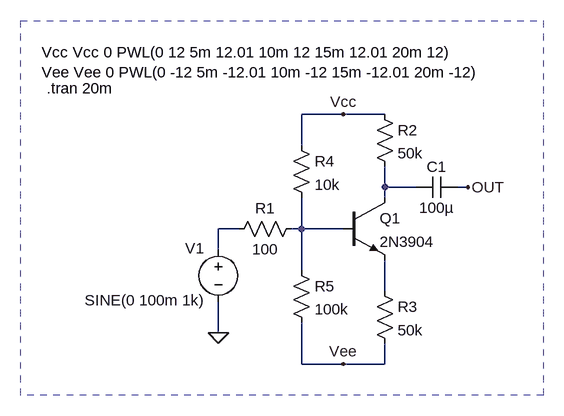
[diagram p0: schematic PSRR_Example.asc]
PSRR_Example.asc, the LTspice schematic file:
Version 4
SHEET 1 880 680
WIRE 416 16 352 16
WIRE 480 16 416 16
WIRE 352 64 352 16
WIRE 480 128 480 96
WIRE 528 128 480 128
WIRE 608 128 592 128
WIRE 480 144 480 128
WIRE 256 192 224 192
WIRE 352 192 352 144
WIRE 352 192 336 192
WIRE 416 192 352 192
WIRE 224 224 224 192
WIRE 352 256 352 192
WIRE 480 288 480 240
WIRE 224 352 224 304
WIRE 352 400 352 336
WIRE 416 400 352 400
WIRE 480 400 480 368
WIRE 480 400 416 400
FLAG 224 352 0
FLAG 608 128 OUT
FLAG 416 16 Vcc
FLAG 416 400 Vee
SYMBOL npn 416 144 R0
SYMATTR InstName Q1
SYMATTR Value 2N3904
SYMBOL Res 352 176 R90
WINDOW 0 0 56 VBottom 2
WINDOW 3 32 56 VTop 2
SYMATTR InstName R1
SYMATTR Value 100
SYMBOL Res 464 0 R0
SYMATTR InstName R2
SYMATTR Value 50k
SYMBOL Res 464 272 R0
SYMATTR InstName R3
SYMATTR Value 50k
SYMBOL Cap 592 112 R90
WINDOW 0 0 32 VBottom 2
WINDOW 3 32 32 VTop 2
SYMATTR InstName C1
SYMATTR Value 100µ
SYMBOL Voltage 224 208 R0
WINDOW 0 -51 14 Left 2
WINDOW 3 -206 94 Left 2
SYMATTR InstName V1
SYMATTR Value SINE(0 100m 1k)
SYMBOL Res 336 48 R0
SYMATTR InstName R4
SYMATTR Value 10k
SYMBOL Res 336 240 R0
SYMATTR InstName R5
SYMATTR Value 100k
TEXT -40 -24 Left 2 !.tran 20m
TEXT -48 -80 Left 2 !Vcc Vcc 0 PWL(0 12 5m 12.01 10m 12 15m 12.01 20m 12)\nVee Vee 0 PWL(0 -12 5m -12.01 10m -12 15m -12.01 20m -12)
RECTANGLE Normal -80 -128 724 448 3

The netlist it stands for:
* PSRR_Example.asc
Q1 N001 N003 N004 0 2N3904
R1 N003 N002 100
R2 Vcc N001 50k
R3 N004 Vee 50k
C1 OUT N001 100µ
V1 N002 0 SINE(0 100m 1k)
R4 Vcc N003 10k
R5 N003 Vee 100k
.model NPN NPN
.model PNP PNP
.lib standard.bjt
.tran 20m
Vcc Vcc 0 PWL(0 12 5m 12.01 10m 12 15m 12.01 20m 12)
Vee Vee 0 PWL(0 -12 5m -12.01 10m -12 15m -12.01 20m -12)
.backanno
.end